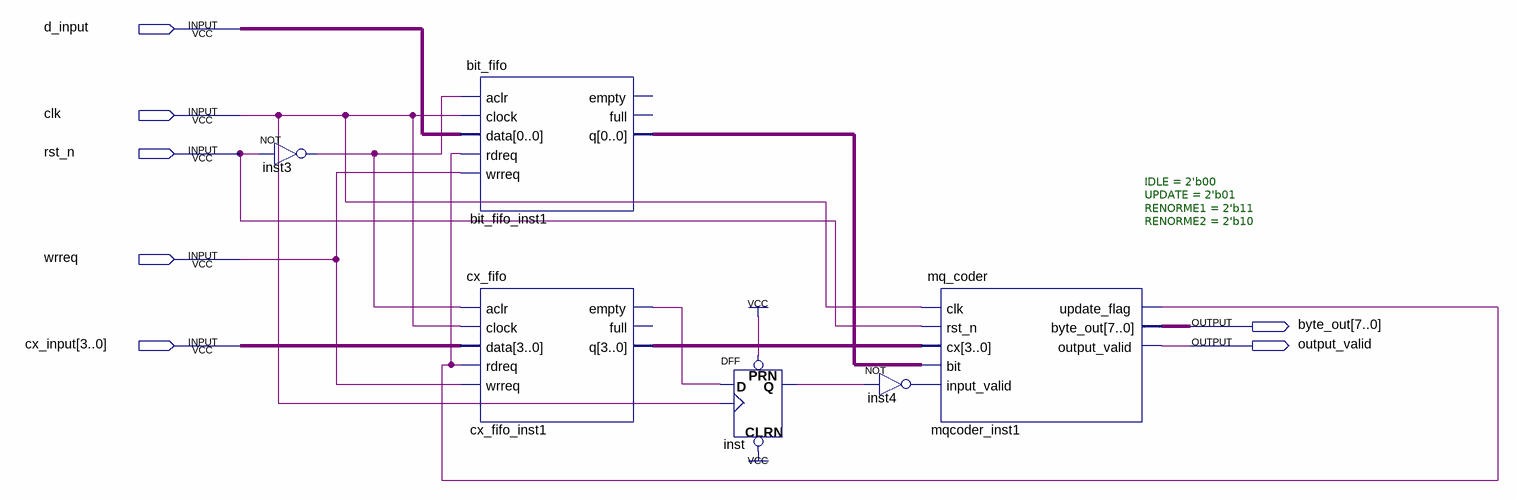
[diagram p0: schematic sheet]
// Quartus schematic code_queue.bdf as structural Verilog: 6 symbols, 7 pins
module code_queue (
  input  d_input,
  input  clk,
  input  rst_n,
  input  wrreq,
  input  [3:0] cx_input,
  output [7:0] byte_out,
  output output_valid
);

  wire bit_fifo_inst1_q, cx_fifo_inst1_empty, inst3_out, inst4_out, inst_q, mqcoder_inst1_update_flag;
  wire [3:0] cx_fifo_inst1_q;

  not inst3 (inst3_out, rst_n);
  bit_fifo bit_fifo_inst1 (
    .aclr(inst3_out), .clock(clk), .data(d_input), .rdreq(mqcoder_inst1_update_flag), .wrreq(wrreq),
    .q(bit_fifo_inst1_q));  // open: empty, full
  cx_fifo cx_fifo_inst1 (
    .aclr(inst3_out), .clock(clk), .data(cx_input), .rdreq(mqcoder_inst1_update_flag), .wrreq(wrreq),
    .empty(cx_fifo_inst1_empty), .q(cx_fifo_inst1_q));  // open: full
  DFF inst (.CLRN(1'b1), .CLK(clk), .D(cx_fifo_inst1_empty), .PRN(1'b1), .Q(inst_q));
  mq_coder #(.IDLE(2'b00), .UPDATE(2'b01), .RENORME1(2'b11), .RENORME2(2'b10)) mqcoder_inst1 (
    .clk(clk), .rst_n(rst_n), .cx(cx_fifo_inst1_q), .\bit (bit_fifo_inst1_q), .input_valid(inst4_out),
    .update_flag(mqcoder_inst1_update_flag), .byte_out(byte_out), .output_valid(output_valid));
  not inst4 (inst4_out, inst_q);
endmodule
